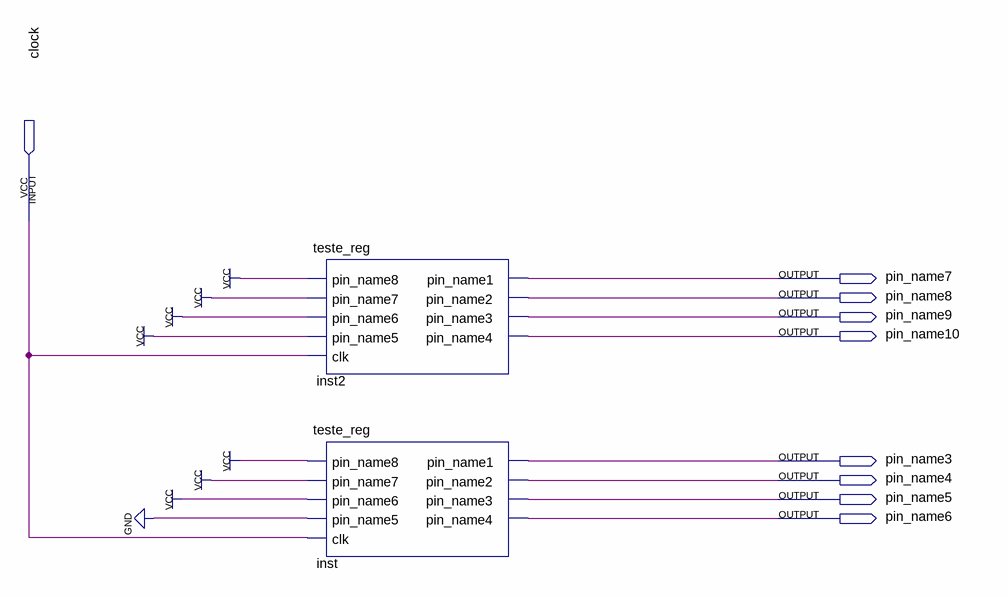
[diagram p0: schematic sheet]
// Quartus schematic Registro.bdf as structural Verilog: 2 symbols, 9 pins
module Registro (
  input  clock,
  output pin_name7,
  output pin_name8,
  output pin_name9,
  output pin_name10,
  output pin_name3,
  output pin_name4,
  output pin_name5,
  output pin_name6
);

  teste_reg inst2 (
    .pin_name8(1'b1), .pin_name7(1'b1), .pin_name6(1'b1), .pin_name5(1'b1), .clk(clock),
    .pin_name1(pin_name7), .pin_name2(pin_name8), .pin_name3(pin_name9), .pin_name4(pin_name10));
  teste_reg inst (
    .pin_name8(1'b1), .pin_name7(1'b1), .pin_name6(1'b1), .pin_name5(1'b0), .clk(clock),
    .pin_name1(pin_name3), .pin_name2(pin_name4), .pin_name3(pin_name5), .pin_name4(pin_name6));
endmodule
